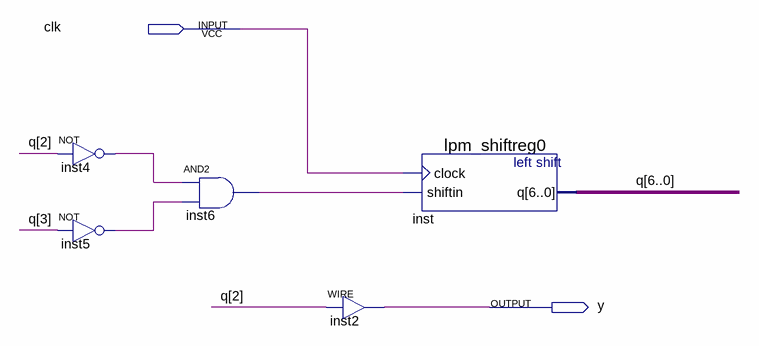
[diagram p0: schematic sheet]
// Quartus schematic lab5.bdf as structural Verilog: 5 symbols, 2 pins
module lab5 (
  input  clk,
  output y
);

  wire inst4_out, inst5_out, inst6_out;
  wire [6:0] q;

  not inst4 (inst4_out, q[2]);
  not inst5 (inst5_out, q[3]);
  and inst6 (inst6_out, inst4_out, inst5_out);
  assign y = q[2];  // WIRE inst2
  lpm_shiftreg0 inst (.clock(clk), .shiftin(inst6_out), .q(q));
endmodule
